# Altium schematic sheet can.SchDoc
size A3; SheetNumber: 5; SheetTotal: 6
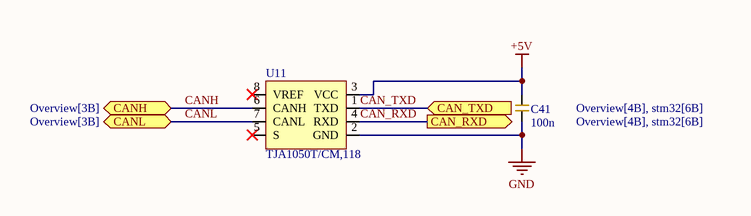
[diagram p0: can.SchDoc]

## Parts
C41  100n  [CAP_0603]
U11  TJA1050T/CM,118  [TJA1050T/CM,118]

## Ports
CAN_RXD (out, see Overview[4B], stm32[6B]), CAN_TXD (in, see Overview[4B], stm32[6B]), CANH (bidir, see Overview[3B]), CANL (bidir, see Overview[3B])

## Nets
+5V: C41.2 U11.3(VCC)
GND: C41.1 U11.2(GND)
CAN_RXD: U11.4(RXD) ; port CAN_RXD
CAN_TXD: U11.1(TXD) ; port CAN_TXD
CANH: U11.6(CANH) ; port CANH
CANL: U11.7(CANL) ; port CANL

Not connected (* = marked no-connect by the designer): U11 5(S)* 8(VREF)*

## Library data of the parts
C41 = CAP_0603: Multilayer Ceramic Capacitors MLCC - SMD/SMT ROHS; Mfr.: *; Voltage Rating: *; Package: 0603; LCSC: *; Mfr. Part: *
U11 = TJA1050T/CM,118: SOP-8 CAN Transceivers ROHS; Mfr.: NXP Semicon; Mfr. Part: TJA1050T/CM,118; LCSC: C6952